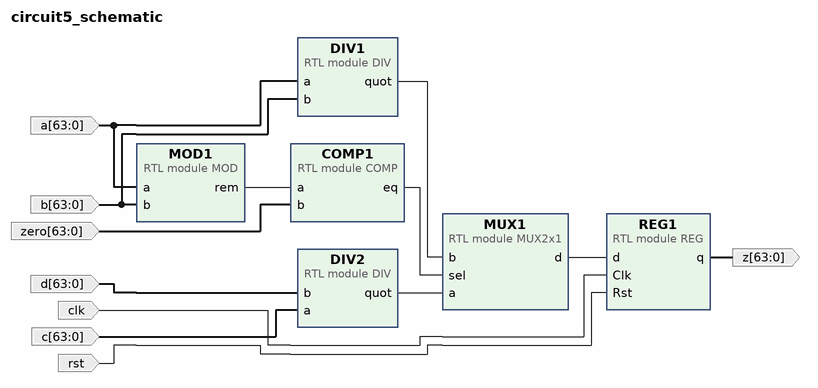
[diagram p0: block diagram of the top level]
# Vivado block design circuit5_schematic, xc7a100tcsg324-1, Vivado 2018.2
create_bd_design circuit5_schematic

create_bd_port -dir I -from 63 -to 0 -type data a
create_bd_port -dir I -from 63 -to 0 -type data b
create_bd_port -dir I -from 63 -to 0 -type data c
create_bd_port -dir I -from 63 -to 0 -type data d
create_bd_port -dir I -from 63 -to 0 -type data zero
create_bd_port -dir I -type clk clk
create_bd_port -dir I -type rst rst
set_property -dict {CONFIG.POLARITY ACTIVE_HIGH} [get_bd_ports rst]
create_bd_port -dir O -from 63 -to 0 -type data z

create_bd_cell -type module -reference DIV DIV1
create_bd_cell -type module -reference DIV DIV2
create_bd_cell -type module -reference MOD MOD1
create_bd_cell -type module -reference COMP COMP1
create_bd_cell -type module -reference MUX2x1 MUX1
create_bd_cell -type module -reference REG REG1

# ---- connections ----

connect_bd_net [get_bd_ports a] [get_bd_pins DIV1/a] [get_bd_pins MOD1/a]
connect_bd_net [get_bd_ports b] [get_bd_pins DIV1/b] [get_bd_pins MOD1/b]
connect_bd_net [get_bd_ports clk] [get_bd_pins REG1/Clk]
connect_bd_net [get_bd_ports rst] [get_bd_pins REG1/Rst]
connect_bd_net [get_bd_pins MUX1/d] [get_bd_pins REG1/d]
connect_bd_net [get_bd_pins DIV1/quot] [get_bd_pins MUX1/b]
connect_bd_net [get_bd_pins DIV2/quot] [get_bd_pins MUX1/a]
connect_bd_net [get_bd_pins COMP1/eq] [get_bd_pins MUX1/sel]
connect_bd_net [get_bd_pins MOD1/rem] [get_bd_pins COMP1/a]
connect_bd_net [get_bd_ports zero] [get_bd_pins COMP1/b]
connect_bd_net [get_bd_ports d] [get_bd_pins DIV2/b]
connect_bd_net [get_bd_ports c] [get_bd_pins DIV2/a]
connect_bd_net [get_bd_pins REG1/q] [get_bd_ports z]

validate_bd_design
save_bd_design
